# EAGLE design Motor_Control_no_mask (EAGLE 7.1.0)
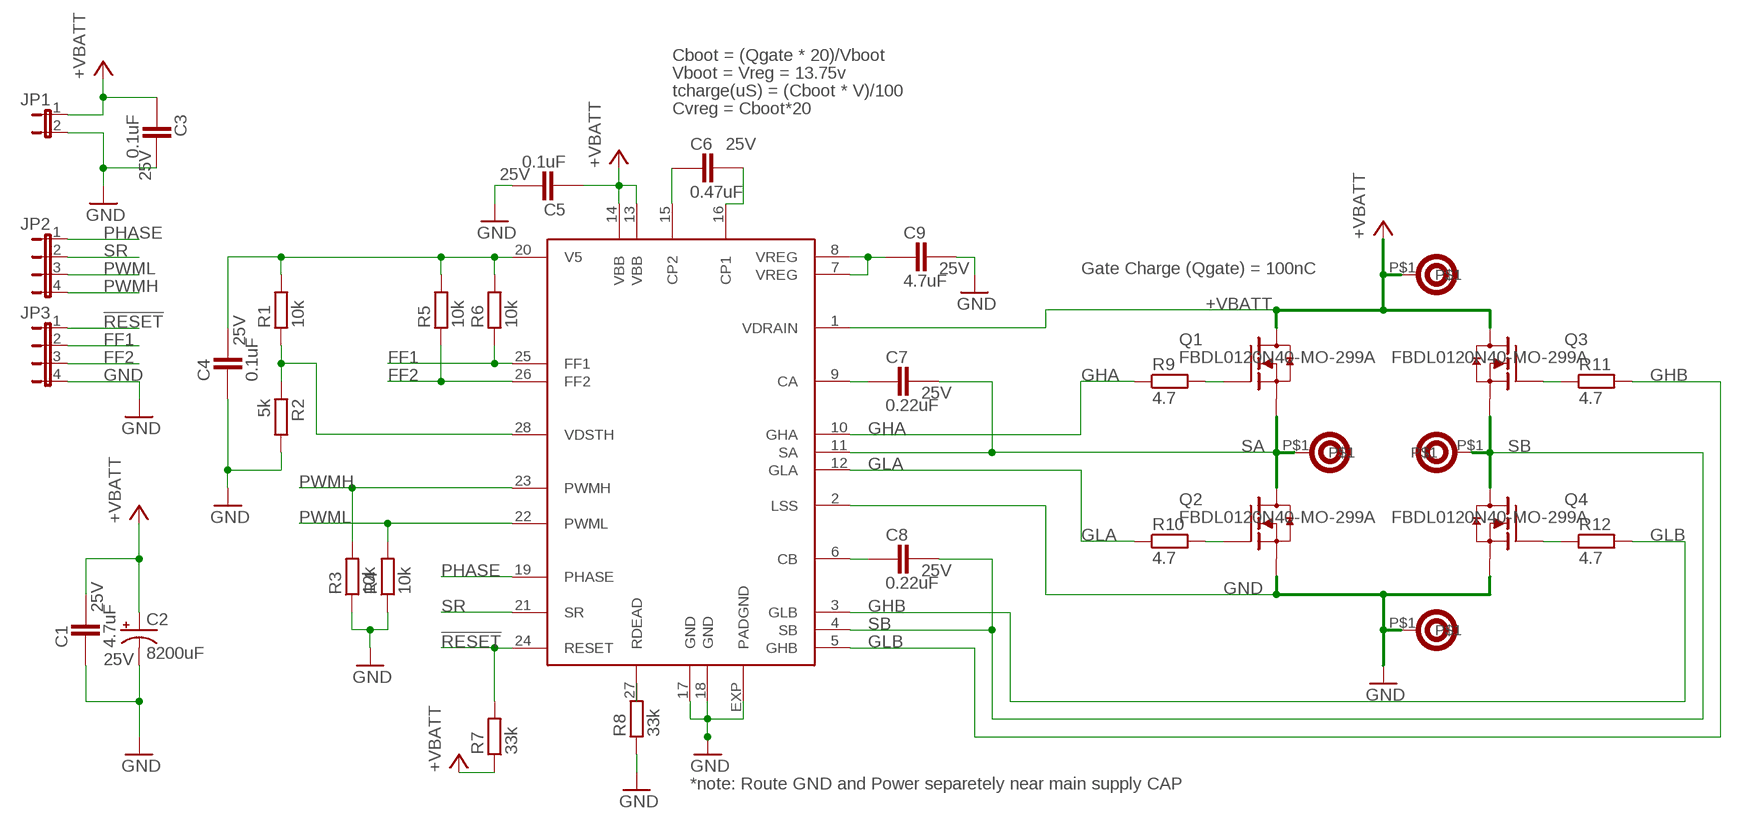
[diagram p0: schematic, sheet 1]

## Parts
C1  4.7uF  CAPACITOR_0603  [CAPC1608X92N]
C2  8200uF  CPOL-US-PTH-10-22  [CAP-10-22]
C3  0.1uF  CAPACITOR_0603  [CAPC1608X92N]
C4  0.1uF  CAPACITOR_0603L  [CAPC_0603_LONG]
C5  0.1uF  CAPACITOR_0603  [CAPC1608X92N]
C6  0.47uF  CAPACITOR_0603  [CAPC1608X92N]
C7  0.22uF  CAPACITOR_0603L  [CAPC_0603_LONG]
C8  0.22uF  CAPACITOR_0603L  [CAPC_0603_LONG]
C9  4.7uF  CAPACITOR_0603  [CAPC1608X92N]
J1  63971-1-QC_TAB-RA  [QUICK_CONN_TAB-RA]
J2  63971-1-QC_TAB-RA  [QUICK_CONN_TAB-RA]
J3  63971-1-QC_TAB-RA  [QUICK_CONN_TAB-RA]
J4  63971-1-QC_TAB-RA  [QUICK_CONN_TAB-RA]
JP1  JP1E  [JP1]
JP2  JP4E  [JP4]
JP3  JP4E  [JP4]
Q1  FBDL0120N40-MO-299A  [MO-299]
Q2  FBDL0120N40-MO-299A  [MO-299]
Q3  FBDL0120N40-MO-299A  [MO-299]
Q4  FBDL0120N40-MO-299A  [MO-299]
R1  10k  RESISTOR_0603  [RESC1608X55N]
R2  5k  RESISTOR_0603  [RESC1608X55N]
R3  10k  RESISTOR_0603  [RESC1608X55N]
R4  10k  RESISTOR_0603  [RESC1608X55N]
R5  10k  RESISTOR_0603  [RESC1608X55N]
R6  10k  RESISTOR_0603  [RESC1608X55N]
R7  33k  RESISTOR_0603  [RESC1608X55N]
R8  33k  RESISTOR_0603  [RESC1608X55N]
R9  4.7  RESISTOR_0603  [RESC1608X55N]
R10  4.7  RESISTOR_0603  [RESC1608X55N]
R11  4.7  RESISTOR_0603  [RESC1608X55N]
R12  4.7  RESISTOR_0603  [RESC1608X55N]
U1  A3941-TSSOP28-LP  [TSSOP28-LP]

## Nets
!RESET: JP3.1 R7.2 U1.24(RESET)
+VBATT: C1.2 C2.+ C3.1 C5.1 J2.P$1 JP1.1 Q1.P$9(D) Q3.P$9(D) R7.1 U1.1(VDRAIN) U1.13(VBB) U1.14(VBB)
FF1: JP3.2 R6.1 U1.25(FF1)
FF2: JP3.3 R5.1 U1.26(FF2)
GHA: R9.1 U1.10(GHA)
GHB: R11.2 U1.5(GHB)
GLA: R10.1 U1.12(GLA)
GLB: R12.2 U1.3(GLB)
GND: C1.1 C2.- C3.2 C4.1 C5.2 C9.2 J4.P$1 JP1.2 JP3.4 Q2.P$2(S) Q2.P$3(S) Q2.P$4(S) Q2.P$5(S) Q2.P$6(S) Q2.P$7(S) Q2.P$8(S) Q4.P$2(S) Q4.P$3(S) Q4.P$4(S) Q4.P$5(S) Q4.P$6(S) Q4.P$7(S) Q4.P$8(S) R2.2 R3.1 R4.1 R8.1 U1.2(LSS) U1.17(GND) U1.18(GND) U1.EXP(PADGND)
N$1: Q1.P$1(G) R9.2
N$2: Q2.P$1(G) R10.2
N$3: Q4.P$1(G) R12.1
N$4: Q3.P$1(G) R11.1
N$5: C9.1 U1.7(VREG) U1.8(VREG)
N$6: C7.1 U1.9(CA)
N$13: R1.1 R2.1 U1.28(VDSTH)
N$15: C8.1 U1.6(CB)
N$17: R8.2 U1.27(RDEAD)
N$19: C6.1 U1.15(CP2)
N$20: C6.2 U1.16(CP1)
PHASE: JP2.1 U1.19(PHASE)
PWMH: JP2.4 R3.2 U1.23(PWMH)
PWML: JP2.3 R4.2 U1.22(PWML)
SA: C7.2 J1.P$1 Q1.P$2(S) Q1.P$3(S) Q1.P$4(S) Q1.P$5(S) Q1.P$6(S) Q1.P$7(S) Q1.P$8(S) Q2.P$9(D) U1.11(SA)
SB: C8.2 J3.P$1 Q3.P$2(S) Q3.P$3(S) Q3.P$4(S) Q3.P$5(S) Q3.P$6(S) Q3.P$7(S) Q3.P$8(S) Q4.P$9(D) U1.4(SB)
SR: JP2.2 U1.21(SR)
V5: C4.2 R1.2 R5.2 R6.2 U1.20(V5)

## Notes on the sheet
- Cboot = (Qgate * 20)/Vboot
- Vboot = Vreg = 13.75v
- tcharge(uS) = (Cboot * V)/100
- Cvreg = Cboot*20
- Gate Charge (Qgate) = 100nC
- *note: Route GND and Power separetely near main supply CAP

## Library data of the parts
C1 C3-C9 = Motor_Control:CAPACITOR_; VOLTAGE: 25V
C2 = Motor_Control:CPOL-US: POLARIZED CAPACITOR, American symbol; MANUFACTURER: Panasonic; MANUFACTURER_PART_NUMBER: ECO-S1EA822BA; VOLTAGE: 25V
J1-J4 = Motor_Control:63971-1; MANUFACTURER: TE Connectivity; MANUFACTURER_PART_NUMBER: 63971-1; MATING_CONNECTOR: TC Conn 62998-2
JP1 = Motor_Control:JP1E: JUMPER
JP2 JP3 = Motor_Control:JP4E: JUMPER
Q1-Q4 = Motor_Control:FBDL0120N40; MANUFACTURER: Fairchild; MANUFACTURER_PART_NUMBER: FDBL0120N40
R1-R12 = Motor_Control:RESISTOR_
U1 = Motor_Control:A3941; DESCRIPTION: Automotive Full Bridge MOSFET Driver; MANUFACTURER: Allegro MicroSystems LLC; MANUFACTURER_PART_NUMBER: A3941

## Board
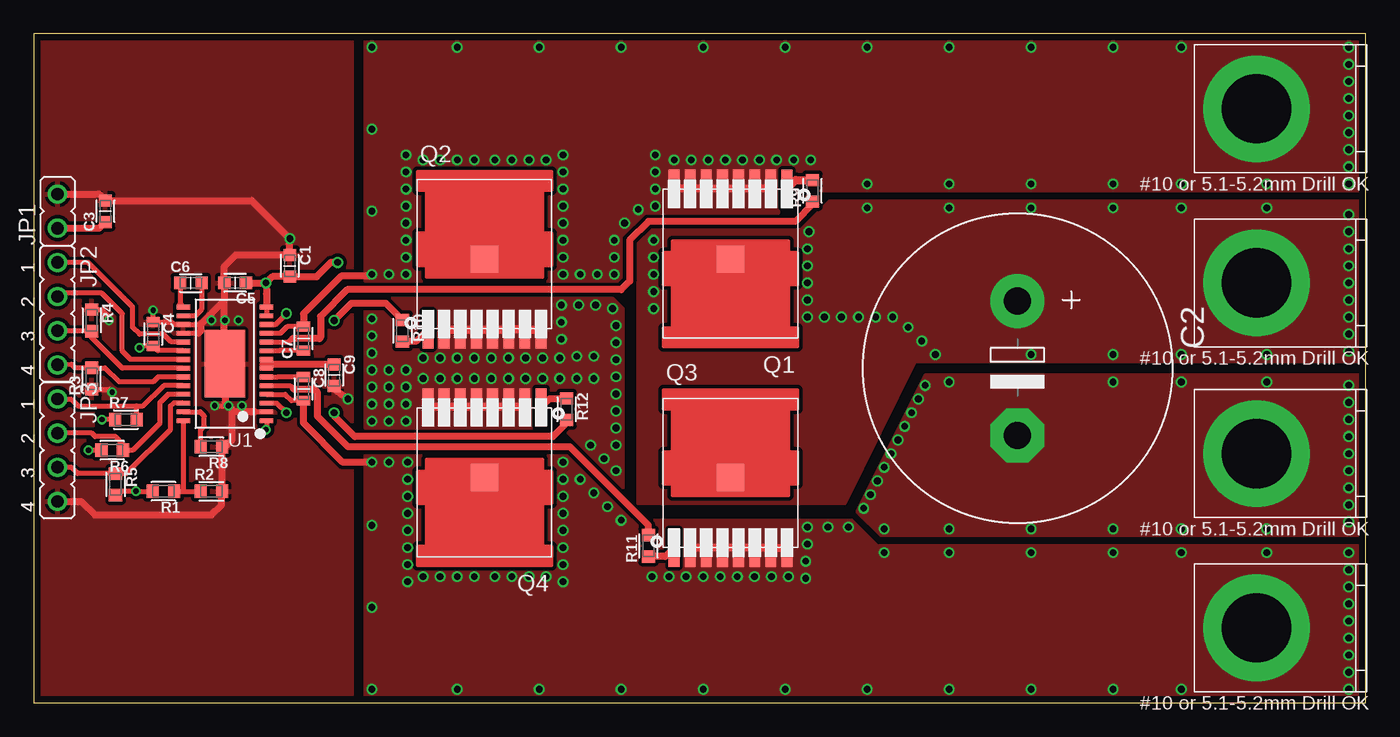
[diagram p1: board, top side]
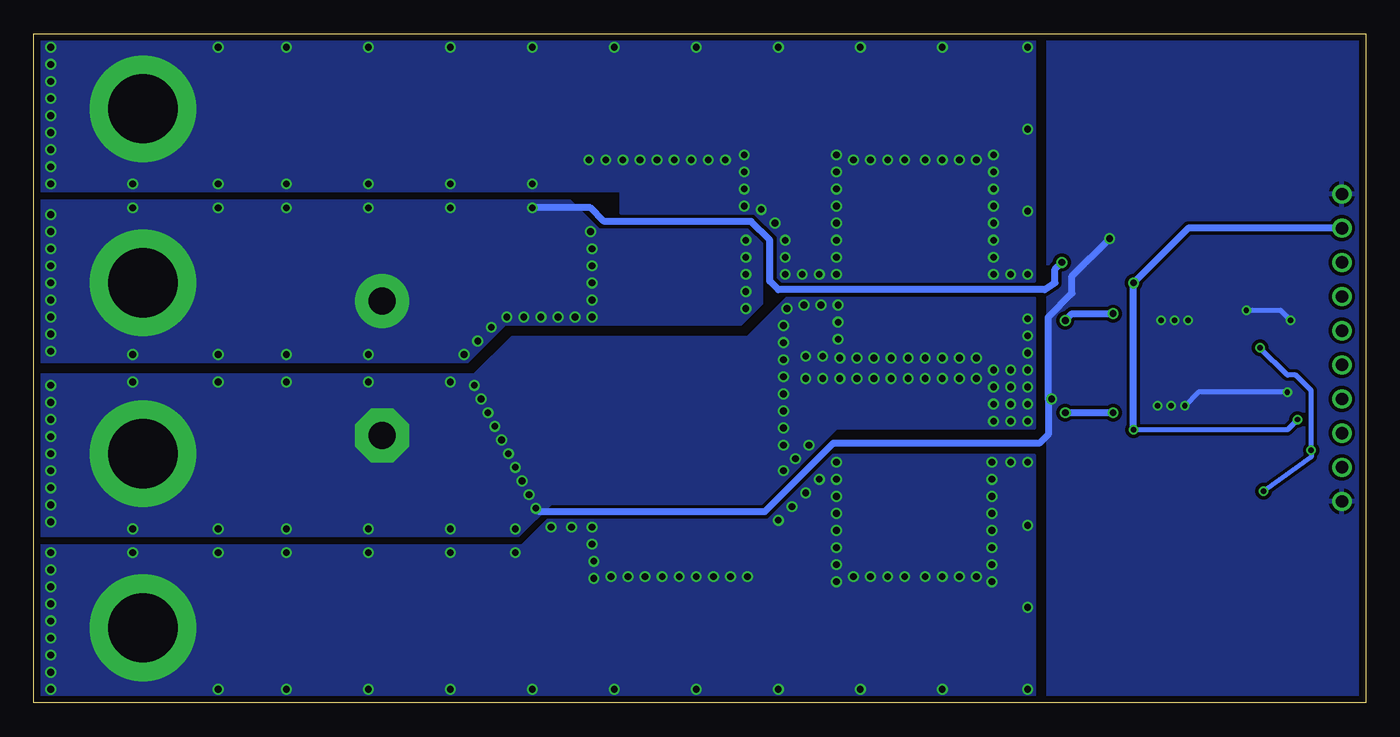
[diagram p2: board, bottom side, seen from below]

Size 99.06 x 49.78 mm. Coordinates in mm from the lower left corner, seen from the top.
Outline: 0,0 99.06,0 99.06,49.78 0,49.78 0,0
Copper layers (1*16): Top 0.035mm / dielectric 1.5mm / Bottom 0.035mm
Design rules "Teensylu Custom *": minimum track width 6mil, minimum drill 12mil, track to track 10mil, track to pad 10mil, pad to pad 10mil, via to via 10mil, smd to smd 0mil, copper to edge 20mil, drill to drill 10mil, minimum pad ring 10mil, minimum via ring 6mil, stop-mask expansion 2mil, vias tented up to drill 100mil, thermal gap 10mil

### Footprints (pad centres in the part's own frame; a part is rotated, then mirrored left to right if it is on the bottom)
CAPC1608X92N = smd 0.9 x 0.95: 1 -0.8,0; 2 0.8,0
CAP-10-22 = drill 2 pad 4: + -5,0 | drill 2 pad 4 octagon: - 5,0
CAPC_0603_LONG = smd 0.737 x 0.991: 1 -0.889,0; 2 0.889,0
QUICK_CONN_TAB-RA = drill 5.156 pad 7.925: P$1 0,0
JP1 = drill 0.914: 1 0,-1.27; 2 0,1.27
JP4 = drill 0.914: 1 -3.81,0; 2 -1.27,0; 3 1.27,0; 4 3.81,0
MO-299 = smd 0.8 x 2.8: P$1 -4.2,-5.24; P$2 -3,-5.24; P$3 -1.8,-5.24; P$4 -0.6,-5.24; P$5 0.6,-5.24; P$6 1.8,-5.24; P$7 3,-5.24; P$8 4.2,-5.24 | smd 2 x 2: P$9 0,0
RESC1608X55N = smd 0.9 x 1: 1 -0.8,0; 2 0.8,0
TSSOP28-LP = smd 0.35 x 1: 1 -4.225,-3.087; 2 -3.575,-3.087; 3 -2.925,-3.087; 4 -2.275,-3.087; 5 -1.625,-3.087; 6 -0.975,-3.087; 7 -0.325,-3.087; 8 0.325,-3.087; 9 0.975,-3.087; 10 1.625,-3.087; 11 2.275,-3.087; 12 2.925,-3.087; 13 3.575,-3.087; 14 4.225,-3.087; 15 4.225,3.087; 16 3.575,3.087; 17 2.925,3.087; 18 2.275,3.087; 19 1.625,3.087; 20 0.975,3.087; 21 0.325,3.087; 22 -0.325,3.087; 23 -0.975,3.087; 24 -1.625,3.087; 25 -2.275,3.087; 26 -2.925,3.087; 27 -3.575,3.087; 28 -4.225,3.087 | smd 5 x 3: EXP 0,0

### Placement (x,y rotation side)
C1  19.05,32.51 270 top
C2  73.15,24.89 270 top
C3  5.33,36.58 90 top
C4  8.89,27.43 270 top
C5  14.99,31.24 180 top
C6  11.68,31.24 0 top
C7  20.07,27.1 90 top
C8  20.07,23.37 270 top
C9  22.35,24.38 270 top
J1  90.93,44.2 90 top
J2  90.93,31.24 90 top
J3  90.93,5.59 90 top
J4  90.93,18.54 90 top
JP1  1.78,36.58 0 top
JP2  1.78,28.96 270 top
JP3  1.78,18.8 270 top
Q1  51.82,33.02 180 top
Q2  33.53,33.02 0 top
Q3  51.82,16.76 0 top
Q4  33.53,16.76 180 top
R1  9.65,15.75 180 top
R2  13.21,15.75 0 top
R3  4.32,24.13 90 top
R4  4.32,28.45 270 top
R5  6.1,16.26 270 top
R6  5.84,18.8 180 top
R7  6.86,21.08 0 top
R8  13.21,19.05 180 top
R9  57.91,38.1 90 top
R10  27.43,27.69 270 top
R11  45.72,11.68 90 top
R12  39.62,21.84 270 top
U1  14.22,25.23 90 top

### Tracks (layer width: path | path; a pad name or v marks a point on that pad's centre or on a via)
!RESET
  Top 0.356: U1.24 9.67,23.6 8.13,22.1 7.66,22.1 | R7.2 7.66,22.1 | JP3.1 2.79,22.61 3.3,22.1 7.66,22.1
+VBATT  (via drill 0.4, 0.5)
  Top 0.356: U1.14 U1.13 | U1.1 17.31,20.36 v17.27,20.32 | R7.1 v5.08,21.08
  Top 0.508: v17.27,31.24 17.31,30.44 U1.14 | C5.1 v17.27,31.24 | v22.61,32.77 22.1,32.77 21.04,31.71 C1.2 17.74,31.71 v17.27,31.24 | JP1.1 4.86,35.31 C3.1
  Bottom 0.356: v5.08,21.08 5.84,20.32 v17.27,20.32
  Bottom 0.508: v61.98,36.83 57.66,36.83 56.64,35.81 45.72,35.81 44.32,34.42 44.32,31.37 43.69,30.73 23.88,30.73 23.11,31.24 23.11,32.26 v22.61,32.77 | v17.27,20.32 v17.27,31.24 13.21,35.31 JP1.1
  other vias: 57.66,35.05 57.53,33.78 57.53,32.51 57.53,31.24 46.1,33.15 46.1,34.42 46.1,31.88 58.8,28.7 97.79,26.16 97.79,27.43 97.79,28.7 97.79,29.97 97.79,31.24 97.79,32.51 97.79,33.78 97.79,35.05 97.79,36.32 85.34,25.91 80.26,25.91 74.17,25.91 67.06,25.91 68.07,36.83 74.17,36.83 80.26,36.83 85.34,36.83 91.69,36.83 57.53,29.97 60.07,28.7 62.61,28.7 63.88,28.7 65.02,27.94 91.69,25.91 57.53,28.7 61.34,28.7 66.04,26.92 46.1,30.61 46.1,29.34
  pour Top: 99.06,37.34 59.18,37.34 57.02,35.18 45.97,35.18 44.96,34.16 44.96,14.86 60.33,14.86 65.53,25.4 99.06,25.4
  pour Bottom: 99.06,37.34 59.18,37.34 57.02,35.18 45.97,35.18 44.96,34.16 44.96,29.72 46.48,28.19 64.01,28.19 66.8,25.4 99.06,25.4
FF1
  Top 0.356: U1.25 10,22.95 9.4,22.35 9.4,20.83 7.37,18.8 R6.1 6.64,19.27 6.1,19.81 4.57,19.81 4.32,20.07 JP3.2
FF2
  Top 0.356: U1.26 10.4,22.3 10.16,22.1 10.16,20.32 6.9,17.06 R5.1 3.26,17.06 2.79,17.53 JP3.3
GHA
  Top 0.356: U1.10 18.98,26.85 19.23,27.1
  Top 0.508: R9.1 57.91,37.08 56.64,35.81 45.72,35.81 44.32,34.42 44.32,31.37 43.69,30.73 23.32,30.73 21.34,28.75 21.34,27.18 21.26,27.1 19.23,27.1
GHB
  Top 0.356: U1.5 19.07,23.6 19.3,23.37
  Top 0.508: R11.2 45.72,13.21 39.88,19.05 23.37,19.05 21.08,21.34 21.08,23.11 20.83,23.37 19.3,23.37
GLA  (via drill 0.5)
  Top 0.356: U1.12 17.99,28.15 v18.8,28.96
  Top 0.508: R10.1 26.2,29.72 23.62,29.72 v22.35,28.45
  Bottom 0.508: v22.35,28.45 21.84,28.96 v18.8,28.96
GLB  (via drill 0.5)
  Top 0.356: U1.3 18.09,22.3 v18.8,21.59
  Top 0.508: R12.2 39.62,20.83 38.61,19.81 23.88,19.81 22.35,21.34 v22.35,21.59
  Bottom 0.508: v22.35,21.59 v18.8,21.59
GND  (via drill 0.4, 0.5)
  Top 0.356: 12.4,28.15 U1.17 10.46,28.15 10.29,28.32 C4.1 v8.89,29.21 | U1.18 12.26,27.5 | U1.2 16.45,21.65 | R3.1 5.63,23.33 v5.84,23.11 | v13.46,22.1 v14.48,22.1 | v5.59,28.45 5.59,28.7 5.04,29.25 R4.1
  Top 0.508: 14.19,29.93 12.4,28.15 12.45,28.11 12.45,27.69 12.26,27.5 | 14.73,21.84 14.73,19.56 14.22,19.05 R8.1 R2.2 13.97,15.96 13.97,14.73 13.21,13.97 4.57,13.97 3.56,14.99 JP3.4 | 14.73,21.84 v14.48,22.1 14.22,22.35 U1.EXP 14.19,25.26 14.19,29.93 | 16.45,21.65 14.93,21.65 14.73,21.84 | 14.19,29.93 C5.2 14.19,32.47 15.02,33.31 C1.1 v19.05,34.54 16.22,37.38 C3.2 4.86,37.85 JP1.2 | C9.2 22.35,23.37 v23.37,22.61
  Top 0.61: Q4.P$2 Q4.P$3 Q4.P$4 Q4.P$5 Q4.P$6 Q4.P$7 Q4.P$8 | Q2.P$2 Q2.P$3 Q2.P$4 Q2.P$5 Q2.P$6 Q2.P$7 Q2.P$8
  Bottom 0.356: v5.84,23.11 12.45,23.11 v13.46,22.1 | v8.89,29.21 6.35,29.21 v5.59,28.45
  Bottom 0.508: v61.72,14.48 61.47,14.22 44.7,14.22 39.62,19.3 24.28,19.3 23.62,19.97 23.62,22.61 | v23.37,22.61 23.62,22.61 | 23.62,22.61 23.62,28.7 21.84,30.48 21.84,31.75 v19.05,34.54
  other vias: 37.85,25.65 39.12,24.13 36.58,25.65 40.39,24.13 27.69,24.77 28.96,25.65 35.31,25.65 34.04,25.65 32.77,25.65 31.5,25.65 30.23,25.65 41.66,24.13 68.07,23.88 91.69,12.95 74.17,12.95 65.28,21.59 64.77,20.57 74.17,23.88 80.26,23.88 80.26,12.95 85.34,12.95 97.79,23.62 97.79,14.73 97.79,16 97.79,22.35 97.79,21.08 97.79,19.81 97.79,18.54 97.79,17.27 97.79,13.46 68.07,12.95 91.69,23.88 62.23,15.49 26.42,23.5 62.74,16.51 63.25,17.53 63.75,18.54 64.26,19.56 43.31,28.07 43.31,26.8 43.31,24.26 43.31,17.27 43.31,19.18 43.31,20.45 43.31,21.72 43.31,22.99 41.4,19.18 25.15,28.57 25.15,27.3 25.15,26.04 25.15,23.5 25.15,22.23 25.15,20.95 65.79,22.61 66.29,23.62 63.25,12.95 85.34,23.88 26.42,24.77 39.24,29.59 39.24,28.32 39.24,27.05 27.69,20.95 26.42,20.95 27.69,22.23 27.69,23.5 40.51,29.59 43.31,25.53 25.15,24.77 43.05,29.34 42.42,18.16 15.49,22.1 14.22,28.45 13.21,28.45 15.24,28.45 26.42,22.23 37.85,24.13 36.58,24.13 28.96,24.13 35.31,24.13 34.04,24.13 32.77,24.13 31.5,24.13 30.23,24.13 41.78,29.59 39.12,25.65 40.39,25.78 41.66,25.78
  pour Top: 99.06,24.38 66.29,24.38 61.21,14.22 62.99,12.45 99.06,12.45
  pour Bottom: 99.06,24.38 66.29,24.38 63.5,27.18 45.97,27.18 43.05,30.1 24.64,30.1 24.64,20.45 39.37,20.45 44.96,14.86 60.58,14.86 62.99,12.45 99.06,12.45
  pour Top: 24.64,30.1 24.64,20.45 39.37,20.45 43.81,16 43.81,29.34 43.05,30.1
  pour Top: 0,49.78 23.62,49.78 23.62,0 0,0
  pour Bottom: 0,49.78 23.62,49.78 23.62,0 0,0
N$1
  Top 0.61: Q1.P$1 56.66,38.9 R9.2
N$2
  Top 0.508: Q2.P$1 28.43,26.89 R10.2
N$3
  Top 0.508: Q4.P$1 38.37,22.64 R12.1
N$4
  Top 0.508: Q3.P$1 46.98,10.88 R11.1
N$5
  Top 0.356: U1.8 U1.7 17.31,25.14 17.27,25.18
  Top 0.508: C9.1 17.27,25.18 17.06,25.18
N$6
  Top 0.356: U1.9 18.25,26.2 18.26,26.21 C7.1
N$13
  Top 0.356: R1.1 11.18,15.75 | 11.18,15.75 R2.1 | U1.28 11.14,16.04 11.18,15.75
N$15
  Top 0.356: U1.6 18.16,24.25 18.16,24.26 C8.1
N$17
  Top 0.356: R8.2 12.41,20.28 12.7,20.57 12.7,21.34 12.38,21.65 U1.27
N$19
  Top 0.356: C6.1 10.88,29.7 U1.15
N$20
  Top 0.356: U1.16 12.04,28.8 12.48,29.25 C6.2
PHASE
  Top 0.356: U1.19 10.23,26.85 9.65,27.43 7.87,27.43 7.37,27.94 7.37,29.46 4.06,32.77 JP2.1
PWMH
  Top 0.356: U1.23 9.27,24.25 8.89,23.88 6.35,23.88 5.3,24.93 R3.2 3.09,24.93 2.83,25.18 JP2.4
PWML
  Top 0.356: U1.22 6.59,24.9 4.32,27.18 R4.2 1.82,27.65 JP2.3
SA  (via drill 0.5)
  Top 0.356: U1.11 18.36,27.5 18.85,27.99 C7.2
  Top 0.508: v25.15,31.88 25.02,31.75 22.86,31.75 20.07,28.96 C7.2
  Top 0.61: Q1.P$2 Q1.P$3 Q1.P$4 Q1.P$5 Q1.P$6 Q1.P$7 Q1.P$8
  other vias: 97.79,39.88 97.79,41.15 97.79,42.42 97.79,43.69 97.79,44.96 97.79,46.23 97.79,47.5 97.79,48.77 85.34,38.61 85.34,48.77 80.26,38.61 74.17,38.61 68.07,38.61 61.98,38.61 80.26,48.77 74.17,48.77 68.07,48.77 61.98,48.77 37.59,48.77 25.15,36.58 55.88,48.77 49.78,48.77 31.5,48.77 27.69,31.88 43.69,48.77 91.69,38.61 25.15,48.77 25.15,42.67 26.42,31.88 39.37,31.88 40.64,31.88 41.91,31.88 43.18,31.88 27.69,33.15 27.69,34.42 27.69,35.69 27.69,36.96 27.69,38.23 27.69,39.5 27.69,40.77 28.96,40.39 30.23,40.39 31.5,40.39 32.77,40.39 34.29,40.39 35.56,40.39 36.83,40.39 38.1,40.39 39.37,33.15 39.37,34.42 39.37,35.69 39.37,36.96 39.37,38.23 39.37,39.5 39.37,40.77 43.18,33.15 43.18,34.42 43.94,35.69 57.78,40.39 44.96,36.7 46.23,36.96 46.23,38.23 46.23,39.5 46.23,40.77 48.9,40.39 47.62,40.39 50.16,40.39 51.44,40.39 52.7,40.39 53.98,40.39 55.24,40.39 56.52,40.39 97.79,38.61
  pour Top (rank 2): 99.06,49.78 24.64,49.78 24.64,31.37 43.43,31.37 43.69,31.62 43.69,34.67 45.47,36.45 55.37,36.45 55.37,38.1 99.06,38.1
  pour Bottom (rank 2): 99.06,49.78 24.64,49.78 24.64,31.37 43.43,31.37 43.69,31.62 43.69,34.67 45.47,36.45 55.37,36.45 55.37,38.1 99.06,38.1
SB  (via drill 0.5)
  Top 0.356: U1.4 18.7,22.95 19.18,22.48 C8.2
  Top 0.508: v25.15,17.91 22.99,17.91 20.07,20.83 C8.2
  Top 0.61: Q3.P$8 Q3.P$7 Q3.P$6 Q3.P$5 Q3.P$4 Q3.P$3 Q3.P$2
  other vias: 97.79,9.91 97.79,8.64 97.79,7.37 97.79,6.1 97.79,4.83 97.79,3.56 97.79,2.29 97.79,1.02 85.34,11.18 80.26,11.18 74.17,11.18 68.07,11.18 63.25,11.18 60.58,13.08 59.05,13.08 57.53,13.08 57.53,11.81 57.4,10.54 57.4,9.27 56.13,9.4 54.86,9.4 53.59,9.4 52.32,9.4 51.05,9.4 49.78,9.4 48.51,9.4 47.24,9.4 91.69,11.18 80.26,1.02 74.17,1.02 68.07,1.02 61.98,1.02 85.34,1.02 25.15,1.02 25.15,13.21 27.81,17.91 25.15,7.11 26.42,17.91 49.78,1.02 43.69,1.02 37.59,1.02 31.5,1.02 55.88,1.02 27.81,16.64 27.81,15.37 27.81,14.1 27.81,12.83 27.81,11.56 27.81,10.29 39.37,17.91 40.64,16.64 41.66,15.62 42.67,14.61 43.69,13.59 39.37,16.64 39.37,15.37 39.37,14.1 39.37,12.83 39.37,11.56 39.37,10.29 38.1,9.4 36.83,9.4 35.56,9.4 34.29,9.4 28.96,9.4 30.23,9.4 31.5,9.4 32.77,9.4 97.79,11.18 45.97,9.4 27.81,9.02 39.37,9.02
  pour Top (rank 2): 24.64,18.41 39.62,18.41 44.45,13.59 60.83,13.59 62.74,11.68 99.06,11.68 99.06,0 24.64,0
  pour Bottom (rank 2): 24.64,18.41 39.62,18.41 44.45,13.59 60.83,13.59 62.74,11.68 99.06,11.68 99.06,0 24.64,0
SR
  Top 0.356: U1.21 7.21,25.55 6.6,26.16 6.6,28.96 5.08,30.48 2.03,30.48 JP2.2
V5  (via drill 0.4)
  Top 0.356: U1.20 9.23,26.2 C4.2 8,26.54 v7.87,26.42 | R6.2 v4.06,18.8 | R1.2 v7.62,15.75 6.13,15.75 R5.2
  Bottom 0.356: v7.62,15.75 4.06,18.29 v4.06,18.8 4.06,23.25 5.2,24.38 5.84,24.38 v7.87,26.42